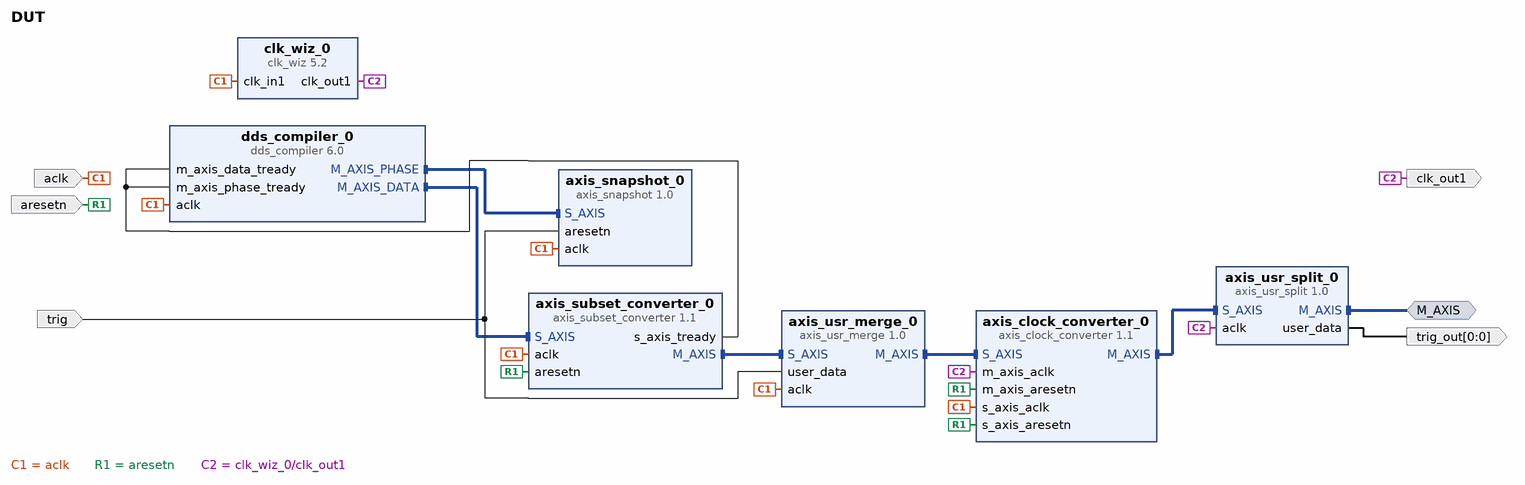
[diagram p0: block diagram of the top level]
# Vivado block design DUT, Vivado 2015.4
create_bd_design DUT

create_bd_intf_port -mode Master -vlnv xilinx.com:interface:axis_rtl:1.0 M_AXIS
set_property -dict {CONFIG.FREQ_HZ 125000000} [get_bd_intf_ports M_AXIS]
create_bd_port -dir I -type clk aclk
set_property -dict {CONFIG.FREQ_HZ 125000000} [get_bd_ports aclk]
create_bd_port -dir I -type rst aresetn
create_bd_port -dir I -type data trig
create_bd_port -dir O -from 0 -to 0 -type data trig_out
create_bd_port -dir O -type clk clk_out1

create_bd_cell -type ip -vlnv xilinx.com:ip:dds_compiler:6.0 dds_compiler_0
set_property -dict [list \
  CONFIG.DDS_Clock_Rate 125 \
  CONFIG.Parameter_Entry Hardware_Parameters \
  CONFIG.Noise_Shaping None \
  CONFIG.Phase_Width 32 \
  CONFIG.Output_Width 14 \
  CONFIG.Has_Phase_Out true \
  CONFIG.Has_TREADY true \
  CONFIG.M_DATA_Has_TUSER Not_Required \
  CONFIG.Latency 9 \
  CONFIG.Has_ARESETn false \
  CONFIG.Output_Frequency1 0 \
  CONFIG.PINC1 1000000000000000000000000000000 \
] [get_bd_cells dds_compiler_0]
create_bd_cell -type ip -vlnv xilinx.com:ip:axis_subset_converter:1.1 axis_subset_converter_0
set_property -dict [list \
  CONFIG.S_TDATA_NUM_BYTES 4 \
  CONFIG.M_TDATA_NUM_BYTES 2 \
  CONFIG.TDATA_REMAP {tdata[15:0]} \
] [get_bd_cells axis_subset_converter_0]
create_bd_cell -type ip -vlnv xilinx.com:ip:axis_clock_converter:1.1 axis_clock_converter_0
set_property -dict {CONFIG.TUSER_WIDTH 2} [get_bd_cells axis_clock_converter_0]
create_bd_cell -type ip -vlnv xilinx.com:ip:clk_wiz:5.2 clk_wiz_0
set_property -dict [list \
  CONFIG.PRIMITIVE PLL \
  CONFIG.USE_MIN_POWER true \
  CONFIG.JITTER_SEL No_Jitter \
  CONFIG.PRIM_IN_FREQ 125 \
  CONFIG.CLKIN1_JITTER_PS 80.0 \
  CONFIG.CLKOUT2_USED true \
  CONFIG.NUM_OUT_CLKS 2 \
  CONFIG.CLKOUT1_REQUESTED_OUT_FREQ 125 \
  CONFIG.CLKOUT2_REQUESTED_OUT_FREQ 250 \
  CONFIG.CLKOUT1_DRIVES BUFG \
  CONFIG.CLKOUT2_DRIVES BUFG \
  CONFIG.CLKOUT3_DRIVES BUFG \
  CONFIG.CLKOUT4_DRIVES BUFG \
  CONFIG.CLKOUT5_DRIVES BUFG \
  CONFIG.CLKOUT6_DRIVES BUFG \
  CONFIG.CLKOUT7_DRIVES BUFG \
  CONFIG.MMCM_DIVCLK_DIVIDE 1 \
  CONFIG.MMCM_CLKFBOUT_MULT_F 8 \
  CONFIG.MMCM_CLKIN1_PERIOD 8.0 \
  CONFIG.MMCM_COMPENSATION ZHOLD \
  CONFIG.MMCM_CLKOUT0_DIVIDE_F 8 \
  CONFIG.MMCM_CLKOUT0_DUTY_CYCLE 0.5 \
  CONFIG.MMCM_CLKOUT1_DIVIDE 4 \
  CONFIG.MMCM_CLKOUT1_DUTY_CYCLE 0.5 \
  CONFIG.CLKOUT1_JITTER 119.348 \
  CONFIG.CLKOUT1_PHASE_ERROR 96.948 \
  CONFIG.CLKOUT2_JITTER 104.759 \
  CONFIG.CLKOUT2_PHASE_ERROR 96.948 \
] [get_bd_cells clk_wiz_0]
create_bd_cell -type ip -vlnv pavel-demin:user:axis_usr_merge:1.0 axis_usr_merge_0
set_property -dict {CONFIG.AXIS_TDATA_WIDTH 16} [get_bd_cells axis_usr_merge_0]
create_bd_cell -type ip -vlnv pavel-demin:user:axis_usr_split:1.0 axis_usr_split_0
set_property -dict {CONFIG.AXIS_TDATA_WIDTH 16} [get_bd_cells axis_usr_split_0]
create_bd_cell -type ip -vlnv pavel-demin:user:axis_snapshot:1.0 axis_snapshot_0

# ---- connections ----

connect_bd_intf_net [get_bd_intf_pins dds_compiler_0/M_AXIS_DATA] [get_bd_intf_pins axis_subset_converter_0/S_AXIS]
connect_bd_intf_net [get_bd_intf_pins axis_subset_converter_0/M_AXIS] [get_bd_intf_pins axis_usr_merge_0/S_AXIS]
connect_bd_intf_net [get_bd_intf_pins axis_usr_merge_0/M_AXIS] [get_bd_intf_pins axis_clock_converter_0/S_AXIS]
connect_bd_intf_net [get_bd_intf_pins axis_clock_converter_0/M_AXIS] [get_bd_intf_pins axis_usr_split_0/S_AXIS]
connect_bd_intf_net [get_bd_intf_pins axis_snapshot_0/S_AXIS] [get_bd_intf_pins dds_compiler_0/M_AXIS_PHASE]
connect_bd_intf_net [get_bd_intf_ports M_AXIS] [get_bd_intf_pins axis_usr_split_0/M_AXIS]
connect_bd_net [get_bd_ports aclk] \
  [get_bd_pins dds_compiler_0/aclk] [get_bd_pins axis_subset_converter_0/aclk] \
  [get_bd_pins axis_clock_converter_0/s_axis_aclk] [get_bd_pins clk_wiz_0/clk_in1] [get_bd_pins axis_usr_merge_0/aclk] \
  [get_bd_pins axis_snapshot_0/aclk]
connect_bd_net [get_bd_ports aresetn] \
  [get_bd_pins axis_subset_converter_0/aresetn] [get_bd_pins axis_clock_converter_0/s_axis_aresetn] \
  [get_bd_pins axis_clock_converter_0/m_axis_aresetn]
connect_bd_net [get_bd_ports trig] [get_bd_pins axis_usr_merge_0/user_data] [get_bd_pins axis_snapshot_0/aresetn]
connect_bd_net [get_bd_pins axis_usr_split_0/user_data] [get_bd_ports trig_out]
connect_bd_net [get_bd_pins clk_wiz_0/clk_out1] \
  [get_bd_ports clk_out1] [get_bd_pins axis_clock_converter_0/m_axis_aclk] [get_bd_pins axis_usr_split_0/aclk]
connect_bd_net [get_bd_pins axis_subset_converter_0/s_axis_tready] \
  [get_bd_pins dds_compiler_0/m_axis_data_tready] [get_bd_pins dds_compiler_0/m_axis_phase_tready]

validate_bd_design
save_bd_design
